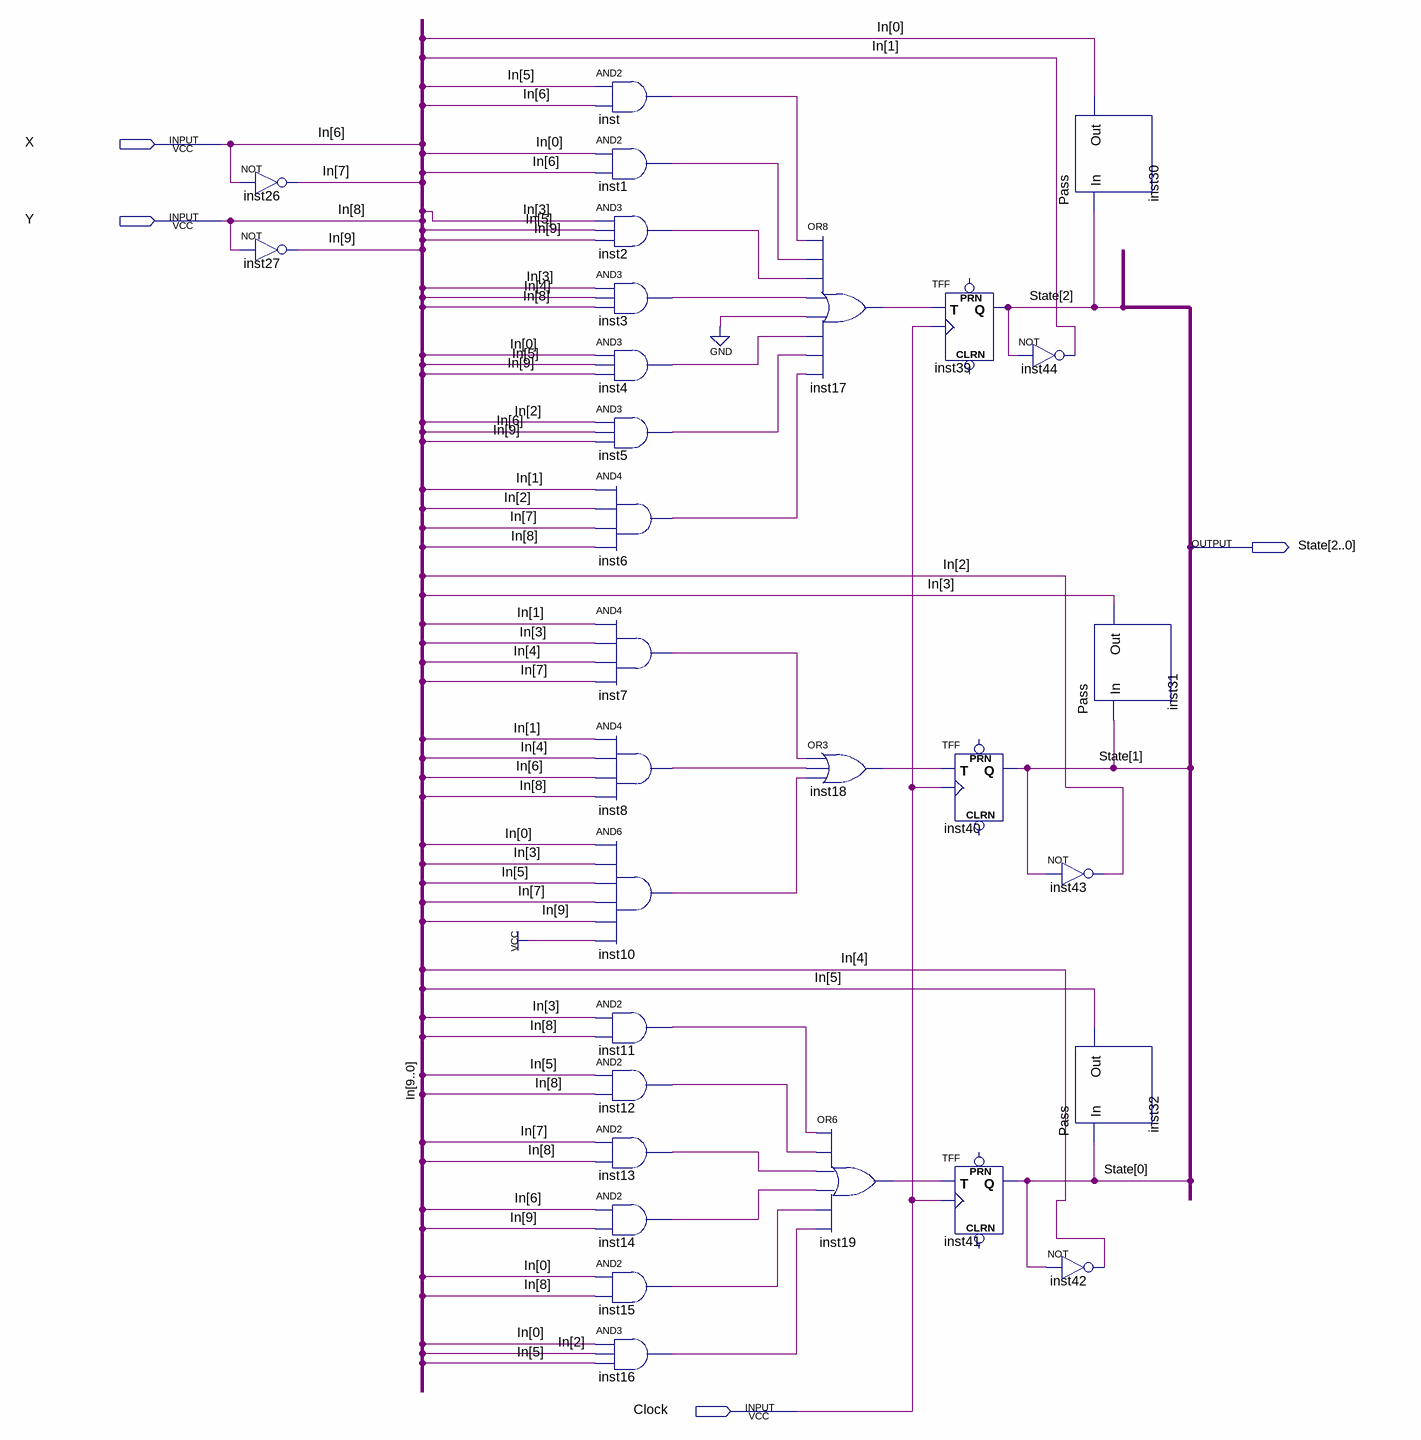
[diagram p0: schematic sheet]
// Quartus schematic RecongniserLogic.bdf as structural Verilog: 30 symbols, 4 pins
module RecongniserLogic (
  input  X,
  input  Y,
  input  Clock,
  output [2:0] State
);

  wire inst1_out, inst2_out, inst3_out, inst4_out, inst5_out, inst6_out, inst7_out, inst8_out, inst10_out,
       inst11_out, inst12_out, inst13_out, inst14_out, inst15_out, inst16_out, inst17_out, inst18_out,
       inst19_out, inst_out;
  wire [9:0] In;

  not inst26 (In[7], X);
  not inst27 (In[9], Y);
  and inst (inst_out, In[5], X);
  and inst1 (inst1_out, In[0], X);
  and inst2 (inst2_out, In[3], In[5], In[9]);
  and inst3 (inst3_out, In[3], In[4], Y);
  and inst4 (inst4_out, In[0], In[5], In[9]);
  and inst5 (inst5_out, In[2], X, In[9]);
  and inst6 (inst6_out, In[1], In[2], In[7], Y);
  and inst7 (inst7_out, In[1], In[3], In[4], In[7]);
  and inst8 (inst8_out, In[1], In[4], X, Y);
  and inst10 (inst10_out, In[0], In[3], In[5], In[7], In[9], 1'b1);
  and inst11 (inst11_out, In[3], Y);
  and inst12 (inst12_out, In[5], Y);
  and inst13 (inst13_out, In[7], Y);
  and inst14 (inst14_out, X, In[9]);
  and inst15 (inst15_out, In[0], Y);
  and inst16 (inst16_out, In[0], In[2], In[5]);
  or inst17 (inst17_out, inst_out, inst1_out, inst2_out, inst3_out, 1'b0, inst4_out, inst5_out, inst6_out);
  or inst18 (inst18_out, inst7_out, inst8_out, inst10_out);
  or inst19 (inst19_out, inst11_out, inst12_out, inst13_out, inst14_out, inst15_out, inst16_out);
  TFF inst39 (.T(inst17_out), .CLK(Clock), .Q(State[2]));  // open: PRN, CLRN
  TFF inst40 (.T(inst18_out), .CLK(Clock), .Q(State[1]));  // open: PRN, CLRN
  TFF inst41 (.T(inst19_out), .CLK(Clock), .Q(State[0]));  // open: PRN, CLRN
  Pass inst30 (.In(State[2]), .Out(In[0]));
  not inst44 (In[1], State[2]);
  Pass inst31 (.In(State[1]), .Out(In[3]));
  not inst43 (In[2], State[1]);
  Pass inst32 (.In(State[0]), .Out(In[5]));
  not inst42 (In[4], State[0]);

  // Other names for the same wires on the sheet: In (some bits) = {Y, X}
endmodule
